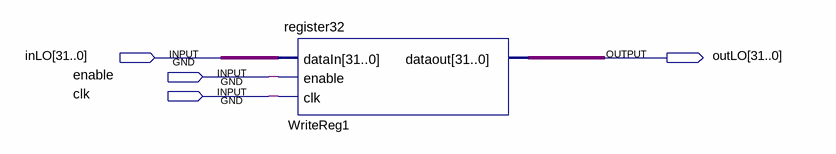
[diagram p0: schematic sheet]
// Quartus schematic LO.bdf as structural Verilog: 1 symbols, 4 pins
module LO (
  input  [31:0] inLO,
  input  enable,
  input  clk,
  output [31:0] outLO
);

  register32 WriteReg1 (.dataIn(inLO), .enable(enable), .clk(clk), .dataout(outLO));

  // Other names for the same wires on the sheet: vcc = enable
endmodule
